# Altium schematic sheet EEM_Connectors.SchDoc: =TopTitle
size 420 x 297 mm; EDA_Number: ARTIQ; CheckedBy: -; Author: G.Kasprowicz; CompanyName: WUT ISE; DrawnBy: G.Kasprowicz; Organization: WUT ISE; Address1: PW ISE; Address2: Nowowiejska 15/19 00-665 Warsaw; Address3: gkasprow@gmail.com; SheetNumber: -; SheetTotal: -; ModifiedBy: -; CheckedDate: -; Title2: -; DivGrp: WUT ISE; Designer: G.Kasprowicz; SPICEModelCacheVGBTAUBO: <root> / <DocumentId>VGBTAUBO</DocumentId> / <CacheFrame Number="0"> / <Model Name="pk14" Kind="CKT"> / <Text>*.INC dhvqfn.s / .SUBCKT pk14 / +    1   2   3   4   5   6   7   8   9  10 / +   11  12  13  14 / +   15  16  17  18  19  20  21  22  23  24 / +   25  26  27  28 / * Pin Resistance / r1 1 1001 9.078E-02 / r2 2 1002 8.829E-02 / r3 3 1003 8.731E-02 / r4 4 1004 8.710E-02 / r5 5 1005 8.731E-02 / r6 6 1006 8.829E-02 / r7 7 1007 9.075E-02 / r8 8 1008 9.072E-02 / r9 9 1009 8.809E-02 / r10 10 1010 8.716E-02 / r11 11 1011 8.706E-02 / r12 12 1012 8.720E-02 / r13 13 1013 8.816E-02 / r14 14 1014 9.068E-02 / * Pin Inductance / l1 1001 15 2.981E-09 / l2 1002 16 2.447E-09 / l3 1003 17 2.304E-09 / l4 1004 18 2.291E-09 / l5 1005 19 2.307E-09 / l6 1006 20 2.449E-09 / l7 1007 21 2.971E-09 / l8 1008 22 2.972E-09 / l9 1009 23 2.425E-09 / l10 1010 24 2.286E-09 / l11 1011 25 2.280E-09 / l12 1012 26 2.286E-09 / l13 1013 27 2.425E-09 / l14 1014 28 2.975E-09 / .ENDS pk14</Text> / </Model> / </CacheFrame> / </root>; ModifiedDate: -; ProjectName: Sensor Box
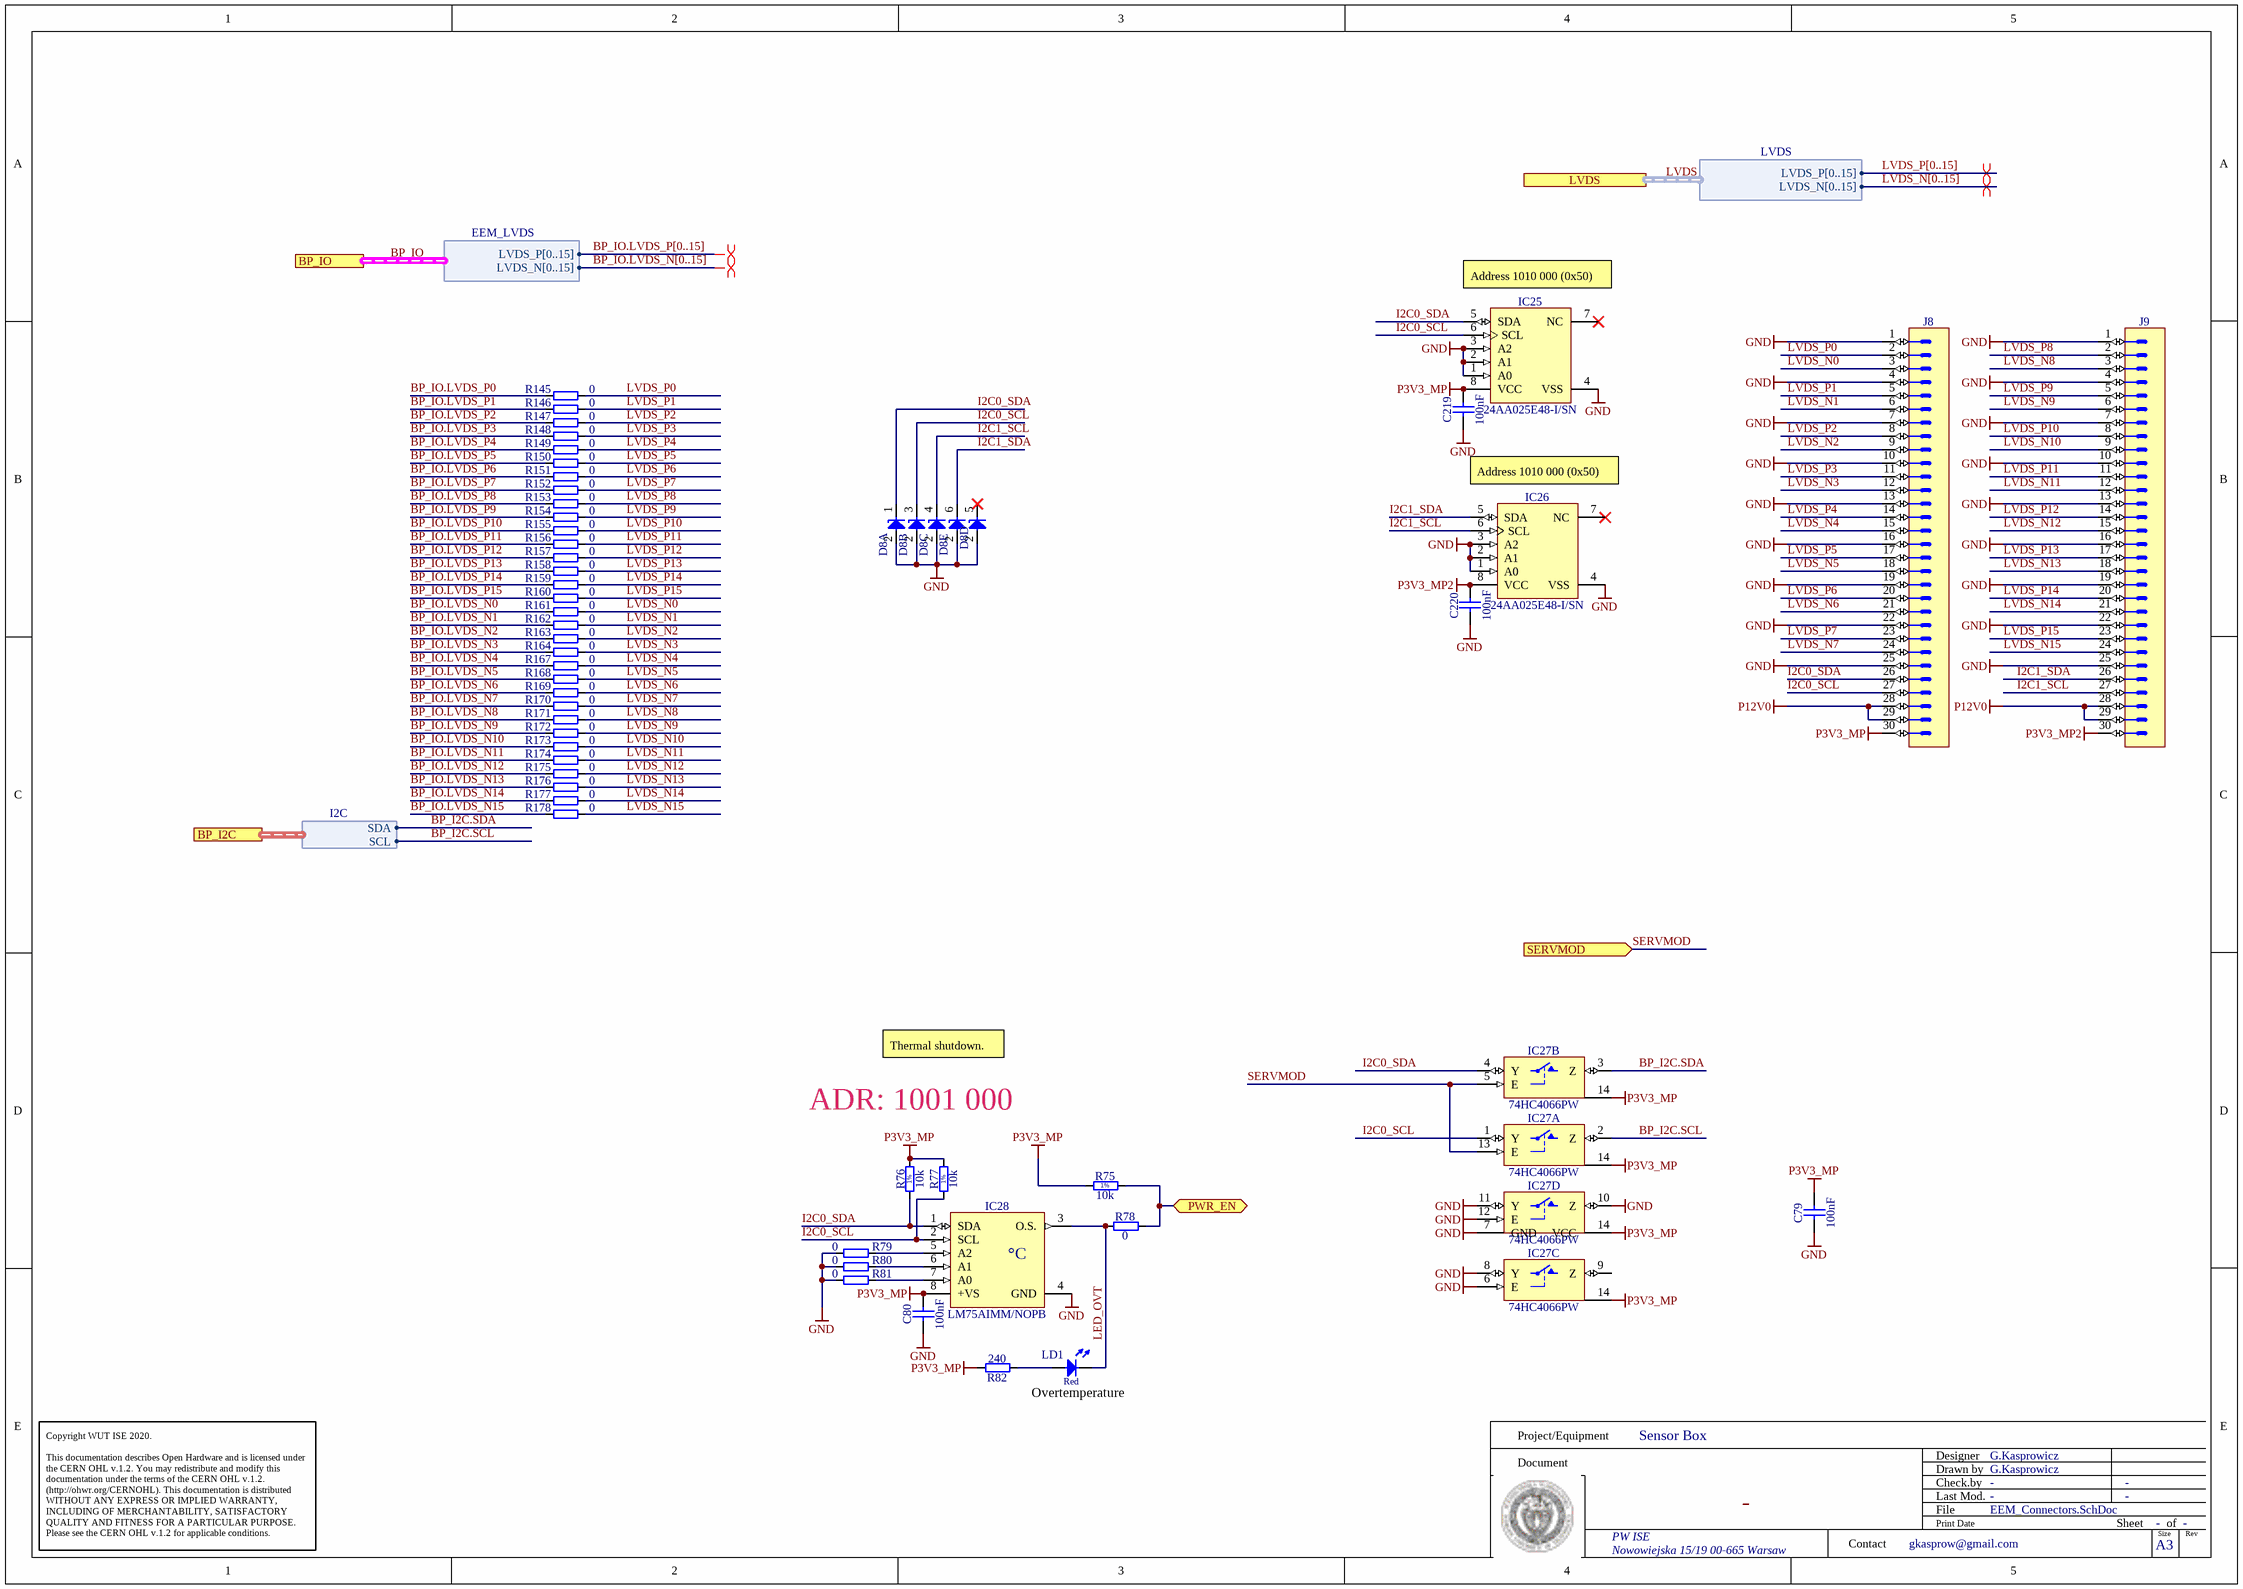
[diagram p0: EEM_Connectors.SchDoc]

## Parts
C79  100nF  [CAPC1005X55N]
C80  100nF  [CAPC1005X55N]
C219  100nF  [CAPC1005X55N]
C220  100nF  [CAPC1005X55N]
D8  PESD3V3L5UY  [SOT65P210X110-6N]  (value not drawn)  (parts A,B,C,D,E of 5)
IC25  24AA025E48-I/SN  [SOIC127P600X175-8N]
IC26  24AA025E48-I/SN  [SOIC127P600X175-8N]
IC27  74HC4066PW  [SOP65P640X110-14N]  (parts A,B,C,D of 4)
IC28  LM75AIMM/NOPB  [SOP65P490X109-8N]
J8  (no value)  [3M_N2530-6002RB]
J9  (no value)  [3M_N2530-6002RB]
LD1  Red  [LED_AVAGO_HSMC-C120]
R75  10k  [RESC1005X40N]
R76  10k  [RESC1005X40N]
R77  10k  [RESC1005X40N]
R78  0  [RESC1005X40N]
R79  0  [RESC1005X40N]
R80  0  [RESC1005X40N]
R81  0  [RESC1005X40N]
R82  240  [RESC1005X40N]
R145  0  [RESC1005X40N]
R146  0  [RESC1005X40N]
R147  0  [RESC1005X40N]
R148  0  [RESC1005X40N]
R149  0  [RESC1005X40N]
R150  0  [RESC1005X40N]
R151  0  [RESC1005X40N]
R152  0  [RESC1005X40N]
R153  0  [RESC1005X40N]
R154  0  [RESC1005X40N]
R155  0  [RESC1005X40N]
R156  0  [RESC1005X40N]
R157  0  [RESC1005X40N]
R158  0  [RESC1005X40N]
R159  0  [RESC1005X40N]
R160  0  [RESC1005X40N]
R161  0  [RESC1005X40N]
R162  0  [RESC1005X40N]
R163  0  [RESC1005X40N]
R164  0  [RESC1005X40N]
R167  0  [RESC1005X40N]
R168  0  [RESC1005X40N]
R169  0  [RESC1005X40N]
R170  0  [RESC1005X40N]
R171  0  [RESC1005X40N]
R172  0  [RESC1005X40N]
R173  0  [RESC1005X40N]
R174  0  [RESC1005X40N]
R175  0  [RESC1005X40N]
R176  0  [RESC1005X40N]
R177  0  [RESC1005X40N]
R178  0  [RESC1005X40N]

## Ports
BP_I2C (harness I2C), BP_IO (harness EEM_LVDS), LVDS (harness LVDS), PWR_EN (bidir), SERVMOD (in)

## Harnesses
I2C: SDA, SCL
EEM_LVDS: LVDS_P[0..15], LVDS_N[0..15]
LVDS: LVDS_P[0..15], LVDS_N[0..15]

## Nets
GND: C79.1 C80.1 C219.1 C220.1 D8.2(A) IC25.1(A0) IC25.2(A1) IC25.3(A2) IC25.4(VSS) IC26.1(A0) IC26.2(A1) IC26.3(A2) IC26.4(VSS) IC27.6(E) IC27.7(GND) IC27.8(Y) IC27.10(Z) IC27.11(Y) IC27.12(E) IC28.4(GND) J8.1 J8.4 J8.7 J8.10 J8.13 J8.16 J8.19 J8.22 J8.25 J9.1 J9.4 J9.7 J9.10 J9.13 J9.16 J9.19 J9.22 J9.25 R79.1 R80.1 R81.1
P3V3_MP: C79.2 C80.2 C219.2 IC25.8(VCC) IC27.14(VCC) IC28.8(+VS) J8.30 R75.1 R76.2 R77.2 R82.2
P3V3_MP2: C220.2 IC26.8(VCC) J9.30
P12V0: J8.28 J8.29 J9.28 J9.29
BP_I2C.SCL: IC27.2(Z) ; port BP_I2C.SCL
BP_I2C.SDA: IC27.3(Z) ; port BP_I2C.SDA
BP_IO.LVDS_N0: R161.1
BP_IO.LVDS_N1: R162.1
BP_IO.LVDS_N2: R163.1
BP_IO.LVDS_N3: R164.1
BP_IO.LVDS_N4: R167.1
BP_IO.LVDS_N5: R168.1
BP_IO.LVDS_N6: R169.1
BP_IO.LVDS_N7: R170.1
BP_IO.LVDS_N8: R171.1
BP_IO.LVDS_N9: R172.1
BP_IO.LVDS_N10: R173.1
BP_IO.LVDS_N11: R174.1
BP_IO.LVDS_N12: R175.1
BP_IO.LVDS_N13: R176.1
BP_IO.LVDS_N14: R177.1
BP_IO.LVDS_N15: R178.1
BP_IO.LVDS_P0: R145.1
BP_IO.LVDS_P1: R146.1
BP_IO.LVDS_P2: R147.1
BP_IO.LVDS_P3: R148.1
BP_IO.LVDS_P4: R149.1
BP_IO.LVDS_P5: R150.1
BP_IO.LVDS_P6: R151.1
BP_IO.LVDS_P7: R152.1
BP_IO.LVDS_P8: R153.1
BP_IO.LVDS_P9: R154.1
BP_IO.LVDS_P10: R155.1
BP_IO.LVDS_P11: R156.1
BP_IO.LVDS_P12: R157.1
BP_IO.LVDS_P13: R158.1
BP_IO.LVDS_P14: R159.1
BP_IO.LVDS_P15: R160.1
I2C0_SCL: D8.3(C) IC25.6(SCL) IC27.1(Y) IC28.2(SCL) J8.27 R77.1
I2C0_SDA: D8.1(C) IC25.5(SDA) IC27.4(Y) IC28.1(SDA) J8.26 R76.1
I2C1_SCL: D8.4(C) IC26.6(SCL) J9.27
I2C1_SDA: D8.6(C) IC26.5(SDA) J9.26
LED_OVT: IC28.3(O.S.) LD1.1(C) R78.1
LVDS_N0: J8.3 R161.2
LVDS_N1: J8.6 R162.2
LVDS_N2: J8.9 R163.2
LVDS_N3: J8.12 R164.2
LVDS_N4: J8.15 R167.2
LVDS_N5: J8.18 R168.2
LVDS_N6: J8.21 R169.2
LVDS_N7: J8.24 R170.2
LVDS_N8: J9.3 R171.2
LVDS_N9: J9.6 R172.2
LVDS_N10: J9.9 R173.2
LVDS_N11: J9.12 R174.2
LVDS_N12: J9.15 R175.2
LVDS_N13: J9.18 R176.2
LVDS_N14: J9.21 R177.2
LVDS_N15: J9.24 R178.2
LVDS_P0: J8.2 R145.2
LVDS_P1: J8.5 R146.2
LVDS_P2: J8.8 R147.2
LVDS_P3: J8.11 R148.2
LVDS_P4: J8.14 R149.2
LVDS_P5: J8.17 R150.2
LVDS_P6: J8.20 R151.2
LVDS_P7: J8.23 R152.2
LVDS_P8: J9.2 R153.2
LVDS_P9: J9.5 R154.2
LVDS_P10: J9.8 R155.2
LVDS_P11: J9.11 R156.2
LVDS_P12: J9.14 R157.2
LVDS_P13: J9.17 R158.2
LVDS_P14: J9.20 R159.2
LVDS_P15: J9.23 R160.2
PWR_EN: R75.2 R78.2 ; port PWR_EN
SERVMOD: IC27.5(E) IC27.13(E) ; port SERVMOD
NetIC28_5: IC28.5(A2) R79.2
NetIC28_6: IC28.6(A1) R80.2
NetIC28_7: IC28.7(A0) R81.2
NetLD1_2: LD1.2(A) R82.1

Not connected (* = marked no-connect by the designer): D8 5(C)*; IC25 7(NC)*; IC26 7(NC)*; IC27 9(Z)

## Buses and harness runs
bus BP_IO.LVDS_N[0..15]
bus BP_IO.LVDS_P[0..15]
bus LVDS_N[0..15]
bus LVDS_P[0..15]
harness BP_IO = port BP_IO
harness LVDS = port LVDS

## Layout directives
differential pair; differential pair class Diff_100Ohm: (no net found under the mark)
differential pair: (no net found under the mark)

## Notes on the sheet
- (near IC25) Address 1010 000 (0x50)
- Address 1010 000 (0x50)
- Thermal shutdown.
- ADR: 1001 000
- Overtemperature
- Project/Equipment
- Document
- Designer
- Drawn by
- Check.by
- Copyright WUT ISE 2020.
  This documentation describes Open Hardware and is licensed under the CERN OHL v.1.2. You may redistribute and modify this documentation under the terms of the CERN OHL v.1.2. (http://ohwr.org/CERNOHL). This documentation is distributed WITHOUT ANY EXPRESS OR IMPLIED WARRANTY, INCLUDING OF MERCHANTABILITY, SATISFACTORY QUALITY AND FITNESS FOR A PARTICULAR PURPOSE. Please see the CERN OHL v.1.2 for applicable conditions.
- Contact
- File
- Last Mod.
- Print Date
- Sheet
- Size
- A3
- of
- Rev
- (in symbol LM75AIMM/NOPB) °C
- (in symbol R0402_10K_1%_0.0625W_100PPM) 1%

## Library data of the parts
C79 C80 C219 C220 = CC0402_100NF_16V_10%_X5R: Non-polarised capacitor; Part Description: SMD Multilayer Chip Ceramic Capacitor; Manufacturer: GENERIC; Manufacturer1 Part Number: GRM155R61C104KA88D; Voltage: 16V; TC: X5R; Tolerance: ±10%; Part Number: CC0402_100NF_16V_10%_X5R; Component Kind: Standard; Component Type: Standard; Pin Count: 2; Value: 100nF; Status: None; Manufacturer Part Number: CC0402_100NF_16V_10%_X5R; Case: 0402; Mounted: Yes; Socket: No; SMD: Yes; Sense: No; Manufacturer1 Example: MURATA; Manufacturer1 ComponentHeight: 0.55mm; HelpURL: \\cern.ch\dfs\Applications\Altium\Datasheets\CC0402_X5R_MURATA_GRM.pdf; Author: CERN DEM JLC; CreateDate: 10.12.2013; LatestRevisionDate: 10.12.2013
D8 = PESD3V3L5UY: Fivefold ESD Protection Diode Arrays; Part Description: Fivefold ESD Protection Diode Arrays (30kV); Manufacturer: NEXPERIA; Voltage: 3.3V; Power: 200W; PressFit: No; Bonding: No; Part Number: PESD3V3L5UY; Component Kind: Standard; Component Type: Standard; Device: PESD3V3L5UY; PackageDescription: SOT363, SC-88, 0.65mm Pitch; 6 Pin, 1.25mm W X 2.00mm L X 1.10mm H body, IPC Medium Density; Manufacturer Part Number: PESD3V3L5UY; Pin Count: 6; Case: SOT363; Mounted: Yes; Socket: No; SMD: Yes; Sense: No; ComponentHeight: 1.1mm; HelpURL: \\cern.ch\dfs\Applications\Altium\Datasheets\PESD3V3L5UY.pdf; Author: CERN DEM WB; CreateDate: 05.07.2021; LatestRevisionDate: 05.07.2021
IC25 IC26 = 24AA025E48-I/SN: 1.7V-5.5V, 2K I2C™ Serial EEPROMs with EUI-48™ Node Identity; Manufacturer: MICROCHIP TECHNOLOGY; PressFit: No; Bonding: No; Part Number: 24AA025E48-I/SN; Component Kind: Standard; Component Type: Standard; Device: 24AA025E48-I/SN; PackageDescription: SOIC 8, Pitch 1.27mm - Body 4x5mm, IPC Medium Density; Part Description: 1.7V-5.5V, 2K I2C™ Serial EEPROMs with EUI-48™ Node Identity; Manufacturer Part Number: 24AA025E48-I/SN; Pin Count: 8; Case: SOIC8; Mounted: Yes; Socket: No; SMD: Yes; Sense: No; ComponentHeight: 1.75mm; HelpURL: \\cern.ch\dfs\Applications\Altium\Datasheets\24AA025E48-I-SN.pdf; Author: CERN DEM MR; CreateDate: 19.07.2016; LatestRevisionDate: 19.07.2016
IC27 = 74HC4066PW: Part Description: Quad Single-Pole Single-Throw Analog Switch; Manufacturer: NXP SEMICONDUCTORS; PressFit: No; Bonding: No; Table: Standard Logic; Part Number: 74HC4066PW; Component Kind: Standard; Component Type: Standard; Device: 74HC4066PW; PackageDescription: SOP, 14-Leads, Body 4.4x5mm (max), Pitch 0.65mm, IPC Medium Density; Manufacturer Part Number: 74HC4066PW; Pin Count: 14; Case: TSSOP14; Mounted: Yes; Socket: No; SMD: Yes; ComponentHeight: 1.1mm; Author: CERN DEM JLC; HelpURL: \\cern.ch\dfs\Applications\Altium\Datasheets\74HC4066PW.pdf; CreateDate: 2014-11-19; LatestRevisionDate: 2014-11-19
IC28 = LM75AIMM/NOPB: Digital Temperature Sensor and Thermal Watchdog with Two-Wire Interface; Part Description: -25° to +100°C ±2°C Digital Temperature Sensor and Thermal Watchdog with Two-Wire Interface; Manufacturer: TEXAS INSTRUMENTS; PressFit: No; Bonding: No; Part Number: LM75AIMM/NOPB; Component Kind: Standard; Component Type: Standard; Device: LM75AIMM/NOPB; PackageDescription: SOP, 0.65mm pitch; 8 pin,3.00mm W X 3.00mm L X 1.09mm H bodyI, PC Medium Density; Manufacturer Part Number: LM75AIMM/NOPB; Pin Count: 8; Case: SSOP8; Mounted: Yes; Socket: No; SMD: Yes; Sense: No; ComponentHeight: 1.09mm; HelpURL: \\cern.ch\dfs\Applications\Altium\Datasheets\LM75AIMM-NOPB.pdf; Author: CERN DEM JLC; CreateDate: 15.10.2012; LatestRevisionDate: 15.10.2012
J8 J9 = 3M_N2530-6002RB: Connector 30 Male; Part Description: 30 Contacts - Straight .100'' x .100'' Low Profile Four-Wall Header, 2500 Series; Manufacturer: 3M; PressFit: No; Part Number: 3M_N2530-6002RB; Component Kind: Standard; Component Type: Standard; Pin Count: 30; Family: Header 30; Mounted: Yes; Socket: No; SMD: No; Sense: No; Status: None; Manufacturer Part Number: N2530-6002RB; ComponentHeight: 10.03mm; HelpURL: \\cern.ch\dfs\Applications\Altium\Datasheets\3M_N2530-6002RB.pdf; Author: CERN DEM JLC; CreateDate: 11.02.2009; LatestRevisionDate: 11.08.2009
LD1 = LED_AVAGO_HSMC-C120: LED Red 1C 2A; Part Description: High Performance Right Angle Chip Red LED; Manufacturer: AVAGO TECHNOLOGIES; PressFit: No; Bonding: No; Part Number: LED_AVAGO_HSMC-C120; Component Kind: Standard; Component Type: Standard; Color: Red; PackageDescription: Red Chip LED, 2-Leads, Body 1.7x1.1mm, Side Emitting Package; Manufacturer Part Number: HSMC-C120; Pin Count: 2; Mounted: Yes; Socket: No; SMD: Yes; Sense: No; ComponentHeight: 0.7mm; HelpURL: \\cern.ch\dfs\Applications\Altium\Datasheets\LED_AVAGO_HSMC-C120.pdf; ComponentLink1URL: \\cern.ch\dfs\Applications\Altium\Datasheets\LED_AVAGO_HSMC-C120_DESIGN-GUIDE.pdf; ComponentLink1Description: Design Guide; Author: CERN DEM JMW; CreateDate: 22.07.2009; LatestRevisionDate: 20.06.2012
R75-R77 = R0402_10K_1%_0.0625W_100PPM: Resistor - 1%; Part Description: General Purpose Thick Film Chip Resistor; Manufacturer: GENERIC; Manufacturer1 Part Number: 232270671003L; TC: ±100ppm/°C; PressFit: No; Part Number: R0402_10K_1%_0.0625W_100PPM; Component Kind: Standard; Component Type: Standard; Pin Count: 2; Value: 10k; Status: Not Recommended; Power: 0.0625W; Tolerance: ±1%; Manufacturer Part Number: R0402_10K_1%_0.0625W_100PPM; Case: 0402; Mounted: Yes; Sense: No; Socket: No; SMD: Yes; Manufacturer1 Example: YAGEO PHYCOMP; Manufacturer1 ComponentHeight: 0.4mm; HelpURL: \\cern.ch\dfs\Applications\Altium\Datasheets\R0402_Phycomp_RC0402.pdf; Author: CERN DEM JLC; CreateDate: 03.12.2007; LatestRevisionDate: 17.10.2012
R78-R81 = R0402_0R_JUMPER: Resistor; Part Description: 1A (0.05R Max DC Resistance) Zero Ohm Jumper; Manufacturer: GENERIC; Manufacturer1 Part Number: 232270591001L; Part Number: R0402_0R_JUMPER; Component Kind: Standard; Component Type: Standard; Pin Count: 2; Value: 0; Status: Not recommended; Manufacturer Part Number: R0402_0R_JUMPER; Case: 0402; Mounted: Yes; Sense: No; Socket: No; SMD: Yes; Manufacturer1 Example: YAGEO PHYCOMP; Manufacturer1 ComponentHeight: 0.4mm; HelpURL: \\cern.ch\dfs\Applications\Altium\Datasheets\R0402_Phycomp_RC0402.pdf; Author: CERN DEM JLC; CreateDate: 03.12.2007; LatestRevisionDate: 17.10.2012
R82 = R0402_240R_1%_0.0625W_100PPM: Resistor - 1%; Part Description: General Purpose Thick Film Chip Resistor; Manufacturer: GENERIC; Manufacturer1 Part Number: 232270672401L; TC: ±100ppm/°C; PressFit: No; Part Number: R0402_240R_1%_0.0625W_100PPM; Component Kind: Standard; Component Type: Standard; Pin Count: 2; Value: 240; Status: Not Recommended; Power: 0.0625W; Tolerance: ±1%; Manufacturer Part Number: R0402_240R_1%_0.0625W_100PPM; Case: 0402; Mounted: Yes; Sense: No; Socket: No; SMD: Yes; Manufacturer1 Example: YAGEO PHYCOMP; Manufacturer1 ComponentHeight: 0.4mm; HelpURL: \\cern.ch\dfs\Applications\Altium\Datasheets\R0402_Phycomp_RC0402.pdf; Author: CERN DEM JLC; CreateDate: 03.12.2007; LatestRevisionDate: 17.10.2012
R145-R164 R167-R178 = R0402_0R_JUMPER: Resistor; Part Description: 1A (0.05R Max DC Resistance) Zero Ohm Jumper; Manufacturer: GENERIC; Manufacturer1 Part Number: 232270591001L; PressFit: No; Part Number: R0402_0R_JUMPER; Component Kind: Standard; Component Type: Standard; Pin Count: 2; Value: 0; Status: Not Recommended; Manufacturer Part Number: R0402_0R_JUMPER; Case: 0402; Mounted: Yes; Sense: No; Socket: No; SMD: Yes; Manufacturer1 Example: YAGEO PHYCOMP; Manufacturer1 ComponentHeight: 0.4mm; HelpURL: \\cern.ch\dfs\Applications\Altium\Datasheets\R0402_Phycomp_RC0402.pdf; Author: CERN DEM JLC; CreateDate: 03.12.2007; LatestRevisionDate: 17.10.2012